# EAGLE design goldcapplatine (EAGLE 6.3)
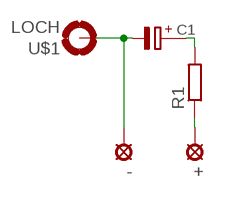
[diagram p0: schematic, sheet 1]

## Parts
+  SE11  [SE11]
-  SE11  [SE11]
C1  PAC-21,5  [PAC-G-2]
R1  R-EU_0207/10  [0207/10]
U$1  LOCH  [LOCH]

## Nets
N$1: +.MP R1.1
N$2: C1.+ R1.2
N$3: -.MP C1.- U$1.B3,0(MOUNT)

## Library data of the parts
+ - = solpad:SE11: SOLDER PAD RTM, drill 1,1mm, distributor Buerklin, 07F810
C1 = Cap-Gold:PAC-21,5
R1 = rcl:R-EU_: RESISTOR, European symbol
U$1 = president_george:LOCH

## Board
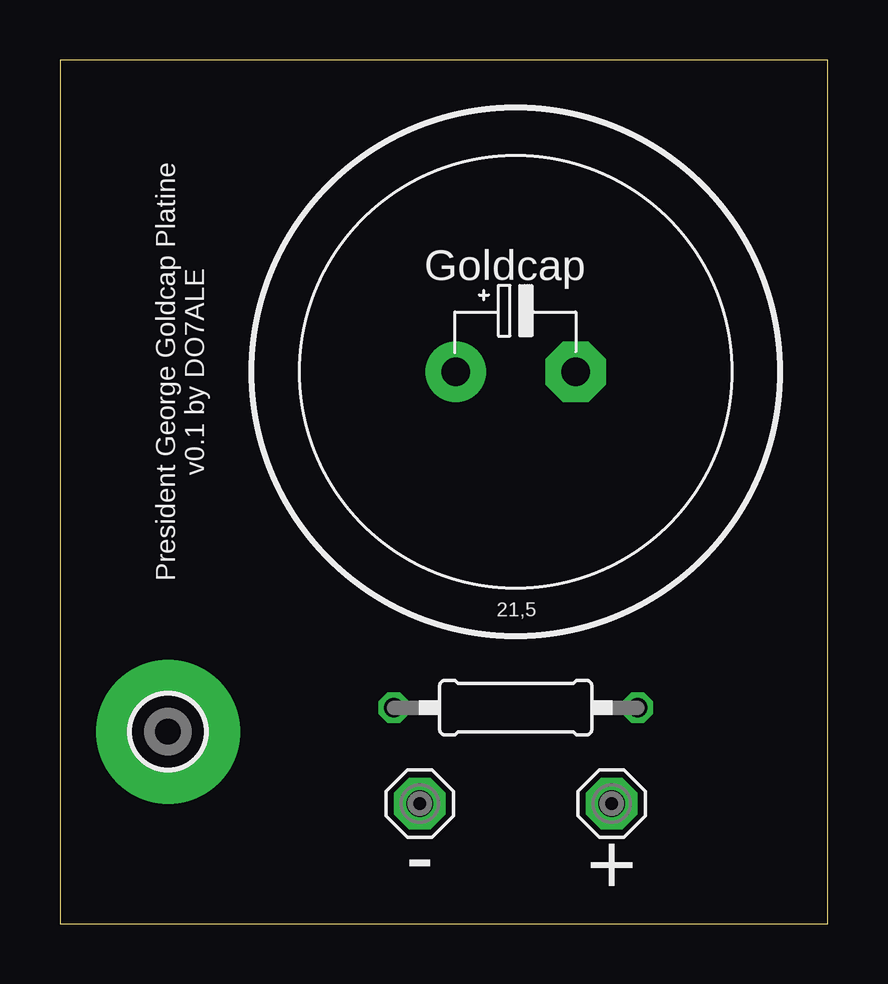
[diagram p1: board, top side]
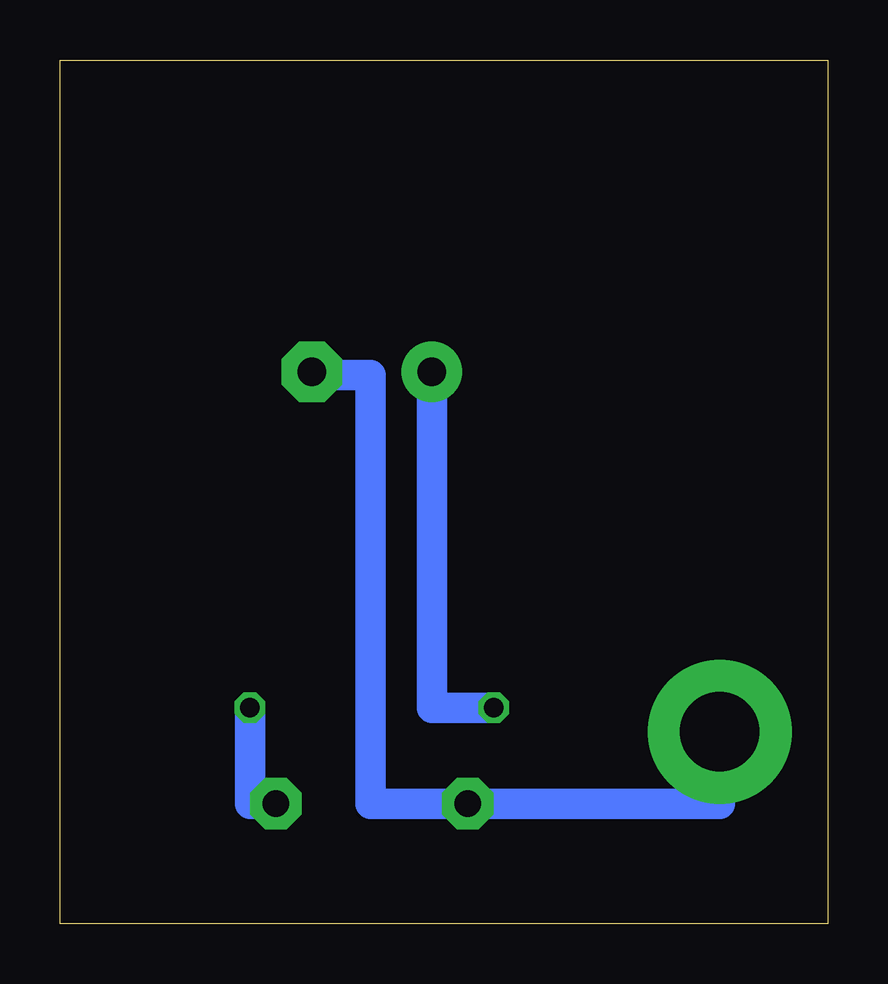
[diagram p2: board, bottom side, seen from below]

Size 32 x 36 mm. Coordinates in mm from the lower left corner, seen from the top.
Outline: 0,0 32,0 32,36 0,36 0,0
Copper layers (1*2+3*4+5*6+7*16): Top 0.035mm / dielectric 0.2mm / Route2 0.035mm / dielectric 0.15mm / Route3 0.035mm / dielectric 0.2mm / Route4 0.035mm / dielectric 0.15mm / Route5 0.035mm / dielectric 0.2mm / Route6 0.035mm / dielectric 0.15mm / Route7 0.035mm / dielectric 0.2mm / Bottom 0.035mm
Design rules "Eagle_WEdirekt_150_check": minimum track width 6mil, minimum drill 0.2mm, track to track 6mil, track to pad 6mil, pad to pad 8mil, via to via 6mil, smd to smd 8mil, copper to edge 12mil, drill to drill 24mil, minimum pad ring 9mil, minimum via ring 9mil, stop-mask expansion 3mil, vias tented up to drill 0mil, thermal gap 12mil

### Footprints (pad centres in the part's own frame; a part is rotated, then mirrored left to right if it is on the bottom)
SE11 = drill 1.118 pad 2.159 octagon: MP 0,0
PAC-G-2 = drill 1.2 pad 2.54: + -2.5,0 | drill 1.2 pad 2.54 octagon: - 2.5,0
0207/10 = drill 0.813 octagon: 1 -5.08,0; 2 5.08,0
LOCH = drill 3.3 pad 6: B3,0 0,0

### Placement (x,y rotation side)
+  23,5 0 top
-  15,5 0 top
C1  19,23 0 top
R1  19,9 180 top
U$1  4.5,8 0 top

### Tracks (layer width: path | path; a pad name or v marks a point on that pad's centre or on a via)
N$1
  Bottom 1.27: +.MP 24.08,5 R1.1
N$2
  Bottom 1.27: R1.2 16.5,9 C1.+
N$3
  Bottom 1.27: U$1.B3,0 4.5,5 -.MP 19.05,5 19.05,22.86 21.5,22.86 C1.-

### Text on the board
tNames: President George Goldcap Platine / v0.1 by DO7ALE